# Altium schematic sheet 24V_Boost.SchDoc
size A4
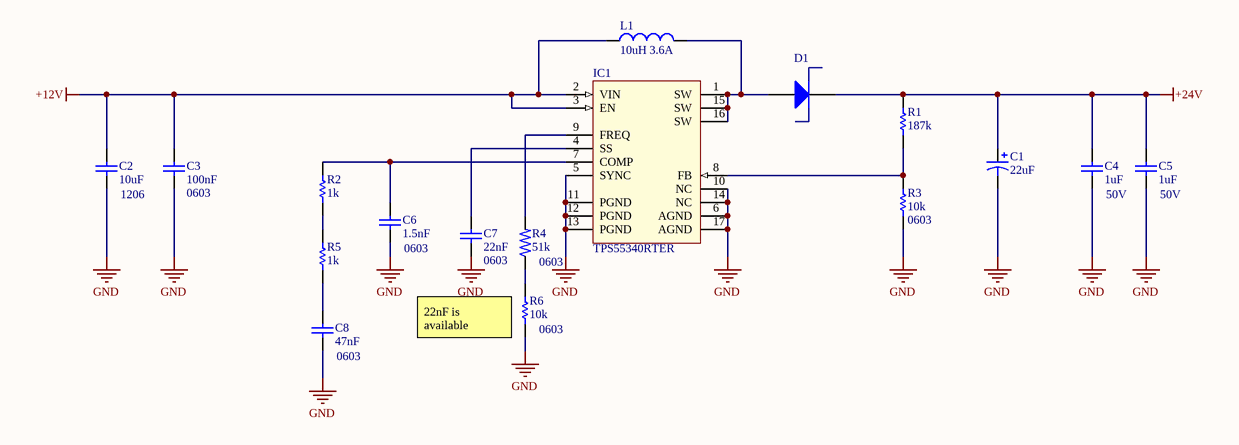
[diagram p0: 24V_Boost.SchDoc]

## Parts
C1  22uF  [PCB-jngp9cavmssoy37xiwaz-1]
C2  10uF  Package / Case: 1206  [CAPC3216X127X50ML20T25]
C3  100nF  Package / Case: 0603  [CAPC1608X09N]
C4  1uF  Voltage-Rated: 50V  [CAPC1608X09N]
C5  1uF  Voltage-Rated: 50V  [CAPC1608X09N]
C6  1.5nF  Package / Case: 0603  [CAPC1608X09N]
C7  22nF  Package / Case: 0603  [CAPC1608X09N]
C8  47nF  Package / Case: 0603  [CAPC1608X09N]
D1  (no value)  [PCB-z3532lqu4iri8rzc55ux-1]
IC1  TPS55340RTER  [VfQFPN 3x3x1.0 16L]
L1  10uH 3.6A  [PCB-aqghgth2fl3irtnr7nhi-1]
R1  187k  [gen0603-2]
R2  1k  [gen0603-2]
R3  10k  Package / Case: 0603  [gen0603-2]
R4  51k  Package / Case: 0603  [PCB-3elf45qdqizoabmczrxc-1]
R5  1k  [gen0603-2]
R6  10k  Package / Case: 0603  [gen0603-2]

## Nets
+12V: C2.2 C3.1 IC1.2(VIN) IC1.3(EN) L1.1
+24V: C1.1 C4.2 C5.2 D1.2(K) R1.2
GND: C1.2 C2.1 C3.2 C4.1 C5.1 C6.1 C7.1 C8.1 IC1.5(SYNC) IC1.6(AGND) IC1.10(NC) IC1.11(PGND) IC1.12(PGND) IC1.13(PGND) IC1.14(NC) IC1.17(AGND) R3.2 R6.1
NetC6_2: C6.2 IC1.7(COMP) R2.2
NetC7_2: C7.2 IC1.4(SS)
NetC8_2: C8.2 R5.2
NetD1_1: D1.1(A) IC1.1(SW) IC1.15(SW) IC1.16(SW) L1.2
NetIC1_8: IC1.8(FB) R1.1 R3.1
NetIC1_9: IC1.9(FREQ) R4.2
NetR2_1: R2.1 R5.1
NetR4_1: R4.1 R6.2

## Notes on the sheet
- (near R6) 22nF is available

## Library data of the parts
C1 = CMP-ceae0666f79b1169-1: Polymer capacitor [Panasonic Automotive & Industrial Systems] 35SVPF22M Polymer capacitor; Manufacture Part Number: OCV220M1VTR-0606; Manufacturer: Lelon; Voltage Rated: 35V; Size-Diameter: 6.30 mm; Supplier Part Number: C473426; Capacitance: 22uF; Supplier: LCSC
C2 = CMP-126371-4: CAP CER 0.1UF 100V 10% X7R 1206; Manufacturer: Samsung Electro-Mechanics; Manufacture Part Number: CL31B106KBHNNNE; Voltage-Rated: 50V; Supplier: LCSC; Capacitance: 10uF; Capacitance Tolerance: 10%; Supplier Part Number: C89632
C3 = CMP-2f55e5122ad9f092-5: 0603 10 nF 50 V ± 10% Tolerance X7R Surface Mount Multilayer Ceramic Capacitor; Manufacture Part Number: CC0603KRX7R9BB104; Manufacturer: YAGEO; Voltage-Rated: 50V; Capacitance Tolerance: 10%; Capacitance: 100nF; Supplier: LCSC; Supplier Part Number: C14663
C4 C5 = CMP-2f55e5122ad9f092-5: 0603 10 nF 50 V ± 10% Tolerance X7R Surface Mount Multilayer Ceramic Capacitor; Manufacture Part Number: CL21B105KBFNNNE; Manufacturer: Samsung Electro-Mechanics; Capacitance: 1uF; Package / Case: 0603; Supplier: LCSC; Supplier Part Number: C28323; Capacitance Tolerance: 10%
C6 = CMP-2f55e5122ad9f092-5: 0603 10 nF 50 V ± 10% Tolerance X7R Surface Mount Multilayer Ceramic Capacitor; Manufacture Part Number: 0603B152K500CT; Manufacturer: Walsin Tech Corp; Voltage-Rated: 50V; Capacitance Tolerance: 10%; Capacitance: 1.5nF; Supplier: LCSC; Supplier Part Number: C302015
C7 = CMP-2f55e5122ad9f092-5_11: 0603 10 nF 50 V ± 10% Tolerance X7R Surface Mount Multilayer Ceramic Capacitor; Manufacture Part Number: CL10B223KB8NNNC; Manufacturer: Samsung Electro-Mechanics; Voltage-Rated: 50V; Capacitance Tolerance: 10%; Capacitance: 22nF; Supplier: LCSC; Supplier Part Number: C21122
C8 = CMP-2f55e5122ad9f092-5: 0603 10 nF 50 V ± 10% Tolerance X7R Surface Mount Multilayer Ceramic Capacitor; Manufacture Part Number: 0603F473M500CT; Manufacturer: Walsin Tech Corp; Capacitance Tolerance: 20%; Voltage-Rated: 50V; Capacitance: 47nF; Supplier: LCSC; Supplier Part Number: C387994
D1 = CMP-d6251f2b0bb209e2-2: Diode, Schottky, 5a, 40v, Do-214ab-2, Full Reel; Manufacturer: Diodes Incorporated; Manufacture Part Number: B540C-13-F; Output Current: 5.00 A (max); Polarity: Standard; Capacitance: 300 pF; Voltage Rating (DC): 40.0 V; Lead-Free Status: Lead Free; Current Rating: 5.00 A; Supplier Part Number: C72264; Supplier: LCSC; OctopartID: d6251f2b0bb209e2; Number of Pins: 2; Octopart URL: http://octopart.com/b540c-13-f-diodes+inc.-325873; REACH SVHC Compliance: No SVHC; Mounting Style: Surface Mount
IC1 = TPS55340RTER: Integrated, 5-A 40-V Wide Input Range Boost/SEPIC/Flyback DC-DC Regulator 16-WQFN -40 to 150; Manufacturer: Texas Instruments; Manufacture Part Number: TPS55340RTER; Supplier Part Number: C169167; Supplier: LCSC
L1 = CMP-8deb4183ed4a522c-1: Inductor Power Shielded Wirewound 10uH 20% 100KHz Metal 4.2A 86.35mOhm DCR Automotive T/R; Manufacture Part Number: SPM6530T-100M-HZ; Manufacturer: TDK; Octopart URL: https://octopart.com/spm6530t-100m-hz-tdk-90326471; OctopartID: 8deb4183ed4a522c; Supplier: LCSC; Supplier Part Number: C360728
R1 = CMP-1853278-27: Surface Mount Thick Film Resistor, RC Series, 1 kohm, 100 mW, - 1%, 50 V, 0603 [1608 Metric]; Manufacturer: UNI-ROYAL(Uniroyal Elec); Manufacture Part Number: 0603WAF1873T5E; Resistance Tolerance: 1%; Supplier: LCSC; Supplier Part Number: C22896; Resistance: 187k; Package / Case: 0603
R2 R5 = CMP-1853278-27: Surface Mount Thick Film Resistor, RC Series, 1 kohm, 100 mW, - 1%, 50 V, 0603 [1608 Metric]; Manufacture Part Number: RC0603FR-071KL; Manufacturer: YAGEO; Package / Case: 0603; Resistance: 1k; Resistance Tolerance: 1%; Supplier: LCSC; Supplier Part Number: C22548
R3 R6 = CMP-1853278-27: Surface Mount Thick Film Resistor, RC Series, 1 kohm, 100 mW, - 1%, 50 V, 0603 [1608 Metric]; Manufacturer: YAGEO; Manufacture Part Number: RC0603FR-0710KL; Resistance Tolerance: 1%; Supplier: LCSC; Supplier Part Number: C98220; Resistance: 10k
R4 = CMP-1853278-23: Surface Mount Thick Film Resistor, RC Series, 1 kohm, 100 mW, - 1%, 50 V, 0603 [1608 Metric]; Manufacturer: Walsin Tech Group; Manufacture Part Number: WR06X513 JTL; Resistance Tolerance: 1%; Resistance: 51k; Supplier: LCSC; Supplier Part Number: C384211